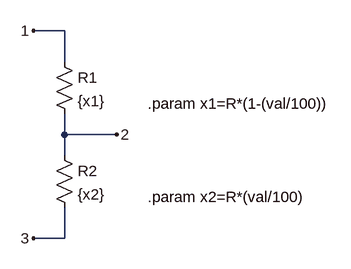
[diagram p0: schematic pot.asc]
pot.asc, the LTspice schematic file:
Version 4
SHEET 1 880 680
WIRE 128 16 80 16
WIRE 128 64 128 16
WIRE 128 176 128 144
WIRE 208 176 128 176
WIRE 128 208 128 176
WIRE 128 336 128 288
WIRE 128 336 80 336
FLAG 80 16 1
FLAG 208 176 2
FLAG 80 336 3
SYMBOL res 112 48 R0
SYMATTR InstName R1
SYMATTR Value {x1}
SYMBOL res 112 192 R0
SYMATTR InstName R2
SYMATTR Value {x2}
TEXT 256 272 Left 2 !.param x2=R*(val/100)
TEXT 256 128 Left 2 !.param x1=R*(1-(val/100))

The netlist it stands for:
* pot.asc
R1 1 2 {x1}
R2 2 3 {x2}
.param x2=R*(val/100)
.param x1=R*(1-(val/100))
.backanno
.end